# Altium schematic sheet Master.SchDoc
size A4; SheetNumber: 1; SheetTotal: 4
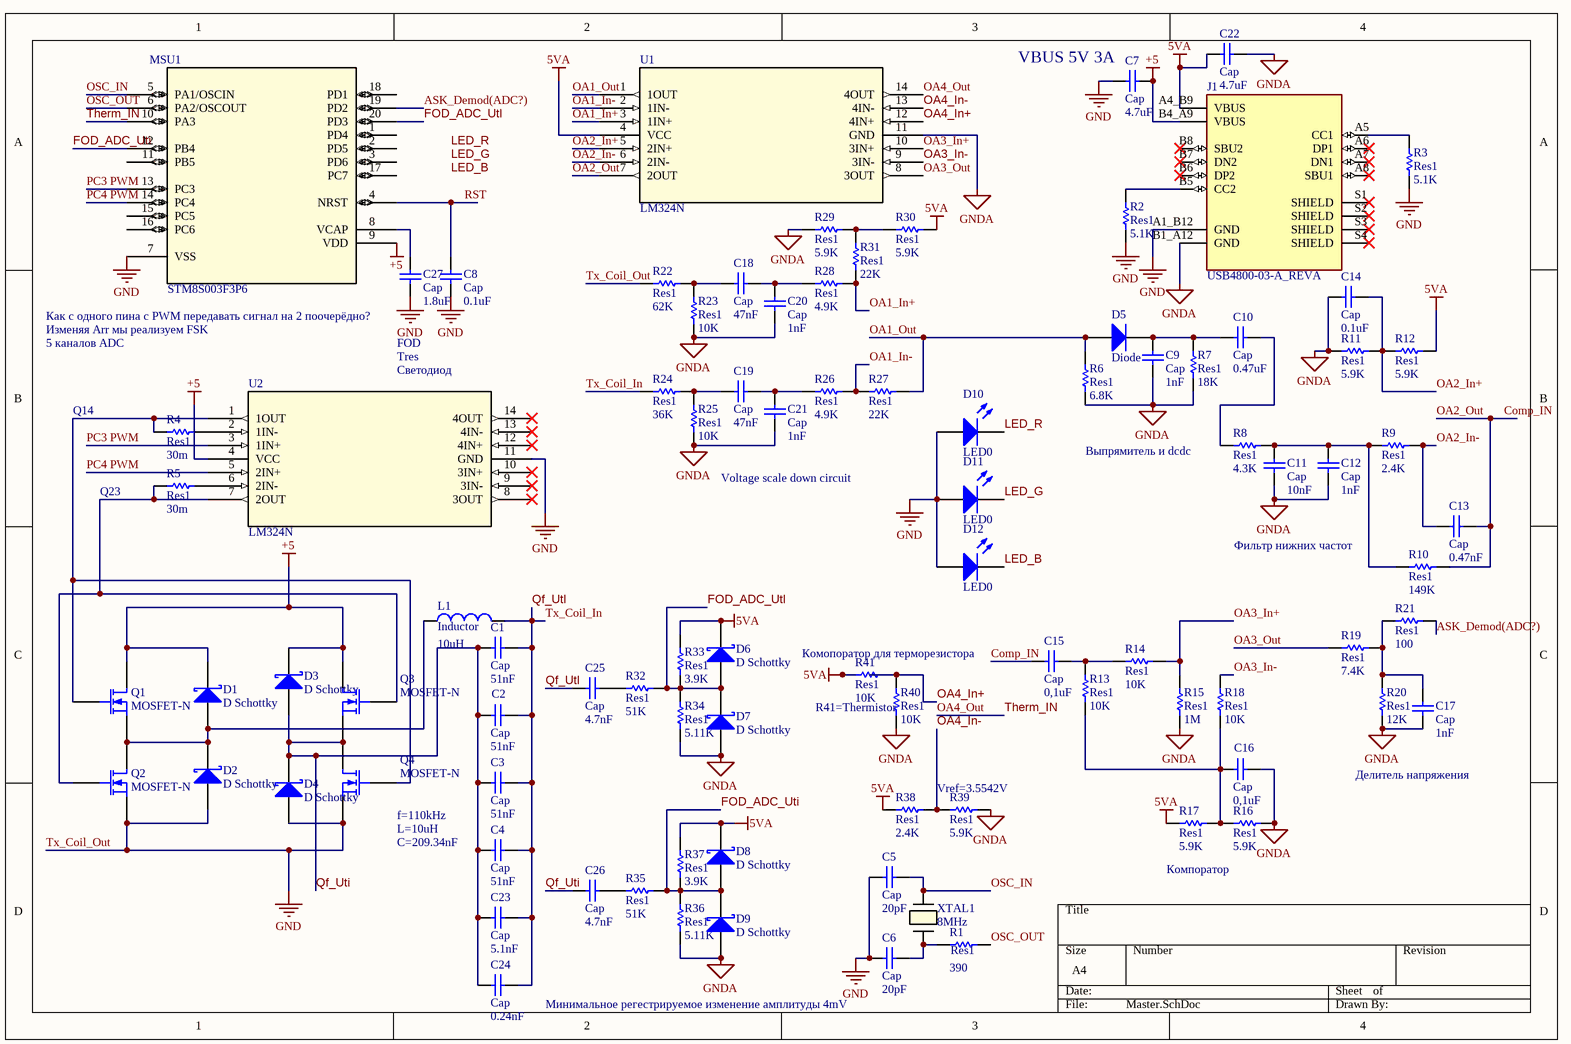
[diagram p0: Master.SchDoc]

## Parts
C1  Cap  value 51nF  [RAD-0.3]
C2  Cap  value 51nF  [RAD-0.3]
C3  Cap  value 51nF  [RAD-0.3]
C4  Cap  value 51nF  [RAD-0.3]
C5  Cap  value 20pF  [RAD-0.3]
C6  Cap  value 20pF  [RAD-0.3]
C7  Cap  value 4.7uF  [RAD-0.3]
C8  Cap  value 0.1uF  [RAD-0.3]
C9  Cap  value 1nF  [RAD-0.3]
C10  Cap  value 0.47uF  [RAD-0.3]
C11  Cap  value 10nF  [RAD-0.3]
C12  Cap  value 1nF  [RAD-0.3]
C13  Cap  value 0.47nF  [RAD-0.3]
C14  Cap  value 0.1uF  [RAD-0.3]
C15  Cap  value 0,1uF  [RAD-0.3]
C16  Cap  value 0,1uF  [RAD-0.3]
C17  Cap  value 1nF  [RAD-0.3]
C18  Cap  value 47nF  [RAD-0.3]
C19  Cap  value 47nF  [RAD-0.3]
C20  Cap  value 1nF  [RAD-0.3]
C21  Cap  value 1nF  [RAD-0.3]
C22  Cap  value 4.7uF  [RAD-0.3]
C23  Cap  value 5.1nF  [RAD-0.3]
C24  Cap  value 0.24nF  [RAD-0.3]
C25  Cap  value 4.7nF  [RAD-0.3]
C26  Cap  value 4.7nF  [RAD-0.3]
C27  Cap  value 1.8uF  [RAD-0.3]
D1  D Schottky  [SMB]
D2  D Schottky  [SMB]
D3  D Schottky  [SMB]
D4  D Schottky  [SMB]
D5  Diode  [SMC]
D6  D Schottky  [SMB]
D7  D Schottky  [SMB]
D8  D Schottky  [SMB]
D9  D Schottky  [SMB]
D10  LED0  [LED-0]
D11  LED0  [LED-0]
D12  LED0  [LED-0]
J1  USB4800-03-A_REVA  [GCT_USB4800-03-A_REVA]
L1  Inductor  value 10uH  [0402-A]
MSU1  STM8S003F3P6  [TSSOP20]
Q1  MOSFET-N  [E3]
Q2  MOSFET-N  [E3]
Q3  MOSFET-N  [E3]
Q4  MOSFET-N  [E3]
R1  Res1  value 390  [AXIAL-0.3]
R2  Res1  value 5.1K  [AXIAL-0.3]
R3  Res1  value 5.1K  [AXIAL-0.3]
R4  Res1  value 30m  [AXIAL-0.3]
R5  Res1  value 30m  [AXIAL-0.3]
R6  Res1  value 6.8K  [AXIAL-0.3]
R7  Res1  value 18K  [AXIAL-0.3]
R8  Res1  value 4.3K  [AXIAL-0.3]
R9  Res1  value 2.4K  [AXIAL-0.3]
R10  Res1  value 149K  [AXIAL-0.3]
R11  Res1  value 5.9K  [AXIAL-0.3]
R12  Res1  value 5.9K  [AXIAL-0.3]
R13  Res1  value 10K  [AXIAL-0.3]
R14  Res1  value 10K  [AXIAL-0.3]
R15  Res1  value 1M  [AXIAL-0.3]
R16  Res1  value 5.9K  [AXIAL-0.3]
R17  Res1  value 5.9K  [AXIAL-0.3]
R18  Res1  value 10K  [AXIAL-0.3]
R19  Res1  value 7.4K  [AXIAL-0.3]
R20  Res1  value 12K  [AXIAL-0.3]
R21  Res1  value 100  [AXIAL-0.3]
R22  Res1  value 62K  [AXIAL-0.3]
R23  Res1  value 10K  [AXIAL-0.3]
R24  Res1  value 36K  [AXIAL-0.3]
R25  Res1  value 10K  [AXIAL-0.3]
R26  Res1  value 4.9K  [AXIAL-0.3]
R27  Res1  value 22K  [AXIAL-0.3]
R28  Res1  value 4.9K  [AXIAL-0.3]
R29  Res1  value 5.9K  [AXIAL-0.3]
R30  Res1  value 5.9K  [AXIAL-0.3]
R31  Res1  value 22K  [AXIAL-0.3]
R32  Res1  value 51K  [AXIAL-0.3]
R33  Res1  value 3.9K  [AXIAL-0.3]
R34  Res1  value 5.11K  [AXIAL-0.3]
R35  Res1  value 51K  [AXIAL-0.3]
R36  Res1  value 5.11K  [AXIAL-0.3]
R37  Res1  value 3.9K  [AXIAL-0.3]
R38  Res1  value 2.4K  [AXIAL-0.3]
R39  Res1  value 5.9K  [AXIAL-0.3]
R40  Res1  value 10K  [AXIAL-0.3]
R41  Res1  value 10K  [AXIAL-0.3]
U1  LM324N  [N14]
U2  LM324N  [N14]
XTAL1  8MHz  [CRYSTAL_ECS-80-18-5PX-TR_ECS]

## Nets
5VA: C22.1 D6.2(K) D8.2(K) J1.A4_B9(VBUS) R12.2 R17.1 R30.2 R33.1 R37.2 R38.1 R41.1 U1.4(VCC)
+5: C7.1 D1.2(K) D3.2(K) J1.B4_A9(VBUS) MSU1.9(VDD) Q1.1(D) Q3.1(D) U2.4(VCC)
GNDA: C9.2 C11.1 C12.2 C14.1 C16.2 C17.2 C20.1 C21.2 C22.2 D7.1(A) D9.1(A) J1.B1_A12(GND) R6.2 R7.2 R11.1 R15.2 R16.2 R20.2 R23.2 R25.1 R29.2 R34.1 R36.1 R39.2 R40.1 U1.11(GND)
Tx_Coil_Out: C5.2 C6.2 C7.2 C8.1 C27.2 D2.1(A) D4.1(A) D10.1(A) D11.1(A) D12.1(A) J1.A1_B12(GND) MSU1.7(VSS) Q2.3(S) Q4.3(S) R2.2 R3.2 R22.2 U2.11(GND)  [also labelled GND]
ASK_Demod(ADC?): MSU1.19(PD2) R21.2
Comp_IN: C13.2 C15.1 R10.2 U1.7(2OUT)  [also labelled OA2_Out]
FOD_ADC_Uti: D8.1(A) D9.2(K) MSU1.12(PB4) R35.2 R36.2 R37.1
FOD_ADC_Utl: D6.1(A) D7.2(K) MSU1.20(PD3) R32.1 R33.2 R34.2
LED_B: D12.2(K)
LED_G: D11.2(K)
LED_R: D10.2(K)
OA1_In+: R28.1 R31.2 U1.3(1IN+)
OA1_In-: R26.2 R27.1 U1.2(1IN-)
OA1_Out: D5.1(A) R6.1 R27.2 U1.1(1OUT)
OA2_In+: C14.2 R11.2 R12.1 U1.5(2IN+)
OA2_In-: C13.1 R9.2 U1.6(2IN-)
OA3_In+: R14.2 R15.1 U1.10(3IN+)
OA3_In-: R18.2 U1.9(3IN-)
OA3_Out: R19.1 U1.8(3OUT)
OA4_In+: R40.2 R41.2 U1.12(4IN+)
OA4_In-: R38.2 R39.1 U1.13(4IN-)
OA4_Out: MSU1.10(PA3) U1.14(4OUT)  [also labelled Therm_IN]
OSC_IN: C5.1 MSU1.5(PA1/OSCIN) XTAL1.1
OSC_OUT: MSU1.6(PA2/OSCOUT) R1.2
PC3 PWM: MSU1.13(PC3) U2.3(1IN+)
PC4 PWM: MSU1.14(PC4) U2.5(2IN+)
Qf_Uti: C1.1 C2.1 C3.1 C4.1 C23.2 C24.1 C26.1 D3.1(A) D4.2(K) Q3.3(S) Q4.1(D)
Qf_Utl: C1.2 C2.2 C3.2 C4.2 C23.1 C24.2 C25.1 L1.2 R24.1  [also labelled Tx_Coil_In]
RST: C8.2 MSU1.4(NRST)
NetC6_1: C6.1 R1.1 XTAL1.2
NetC9_1: C9.1 C10.1 D5.2(K) R7.1
NetC10_2: C10.2 R8.2
NetC11_2: C11.2 C12.1 R8.1 R9.1 R10.1
NetC15_2: C15.2 R13.2 R14.1
NetC16_1: C16.1 R13.1 R16.1 R17.2 R18.1
NetC17_1: C17.1 R19.2 R20.1 R21.1
NetC18_1: C18.1 R22.1 R23.1
NetC18_2: C18.2 C20.2 R28.2
NetC19_1: C19.1 R24.2 R25.2
NetC19_2: C19.2 C21.1 R26.1
NetC25_2: C25.2 R32.2
NetC26_2: C26.2 R35.1
NetC27_1: C27.1 MSU1.8(VCAP)
NetD1_1: D1.1(A) D2.2(K) L1.1 Q1.3(S) Q2.1(D)
NetJ1_A5: J1.A5(CC1) R3.1
NetJ1_B5: J1.B5(CC2) R2.1
NetQ1_2: Q1.2(G) Q4.2(G) R4.1 U2.1(1OUT)
NetQ2_2: Q2.2(G) Q3.2(G) R5.1 U2.7(2OUT)
NetR4_2: R4.2 U2.2(1IN-)
NetR5_2: R5.2 U2.6(2IN-)
NetR29_1: R29.1 R30.1 R31.1

Not connected (* = marked no-connect by the designer): J1 A6(DP1)* A7(DN1)* A8(SBU1)* B6(DP2)* B7(DN2)* B8(SBU2)* S1(SHIELD)* S2(SHIELD)* S3(SHIELD)* S4(SHIELD)*; MSU1 1(PD4) 2(PD5) 3(PD6) 11(PB5) 15(PC5) 16(PC6) 17(PC7) 18(PD1); U2 8(3OUT)* 9(3IN-)* 10(3IN+)* 12(4IN+)* 13(4IN-)* 14(4OUT)*

## Notes on the sheet
- (near C7) VBUS 5V 3A
- (near C27) Как с одного пина с PWM передавать сигнал на 2 поочерёдно?
- Изменяя Arr мы реализуем FSK
- 5 каналов ADC
- FOD
- Tres
- (near U2) Светодиод
- Q14
- Выпрямитель и dcdc
- Q23
- Voltage scale down circuit
- Фильтр нижних частот
- (near R41) Комопоратор для терморезистора
- (near R40) R41=Thermistor
- Vref=3.5542V
- Делитель напряжения
- C=209.34nF
- (near Q4) f=110kHz
- L=10uH
- Компоратор
- Минимальное регестрируемое изменение амплитуды 4mV
- Labels drawn without touching a wire or pin: LED_B, LED_G, LED_R

## Library data of the parts
C1-C27 = Cap: Capacitor; Published: 8-Jun-2000; LatestRevisionDate: 17-Jul-2002; LatestRevisionNote: Re-released for DXP Platform.; PackageReference: RAD-0.3; Publisher: Altium Limited; PackageDescription: Radial Cap, Thru-Hole; 2 Leads; 0.3 in Pin Spacing
D1-D4 D6-D9 = D Schottky: Schottky Diode; Published: 8-Jun-2000; LatestRevisionDate: 17-Jul-2002; LatestRevisionNote: Re-released for DXP Platform.; PackageReference: SMB; Publisher: Altium Limited; PackageDescription: DO-214-AA/SMB; 2 C-Bend Leads; Body 5.3 x 3.6 mm, inc. leads (LxW); Code_JEDEC: DO-214-AA
D5 = Diode: Default Diode; Published: 8-Jun-2000; LatestRevisionDate: 17-Jul-2002; LatestRevisionNote: Re-released for DXP Platform.; PackageVersion: Sep-1996; PackageReference: SMC; Publisher: Altium Limited; PackageDescription: DO-214-AB/SMC; 2 C-Bend Leads; Body 7.9 x 5.9 mm, inc. leads (LxW); Code_JEDEC: DO-214-AB
D10-D12 = LED0: Typical INFRARED GaAs LED; Published: 8-Jun-2000; LatestRevisionDate: 08-Jul-2005; LatestRevisionNote: Mech Layer 1 removed.; PackageReference: LED-0; Publisher: Altium Limited; PackageDescription: LED; 2 Leads
J1 = USB4800-03-A_REVA: USB-C (USB TYPE-C) USB 2.0 Receptacle Connector 24 (16+8 Dummy) Position Surface Mount, Right Angle; Through Hole; MF: Global Connector Technology; SnapEDA_Link: https://www.snapeda.com/parts/USB4800-03-A/Global+Connector+Technology/view-part/?ref=snap; Package: None; MP: USB4800-03-A; Check_prices: https://www.snapeda.com/parts/USB4800-03-A/Global+Connector+Technology/view-part/?ref=eda; Purchase-URL: https://pricing.snapeda.com/search/part/USB4800-03-A/?ref=eda; Price: None; Value: *; Availability: In Stock
L1 = Inductor: Code_IEC: 1005; Published: 8-Jun-2000; LatestRevisionDate: 29-May-2009; LatestRevisionNote: IPC-7351 Footprint Added.; PackageReference: 0402-A; Publisher: Altium Limited; PackageDescription: Chip Inductor; Code_JEITA: 0402
MSU1 = STM8S003F3P6: No Description Available; Mfr_Name: STMicroelectronics; RefDes: RefDes; Type: Type
Q1-Q4 = MOSFET-N: N-Channel MOSFET; Published: 8-Jun-2000; LatestRevisionDate: 17-Jul-2002; LatestRevisionNote: Re-released for DXP Platform.; PackageVersion: 1995/1996; PackageReference: E3; Publisher: Altium Limited; PackageDescription: TO, Flat Index; 3 In-Line, Axial Leads; Body Dia. 4.6mm; Lead Dia. 0.5 mm (max)
R1-R41 = Res1: Resistor; Published: 8-Jun-2000; LatestRevisionDate: 17-Jul-2002; LatestRevisionNote: Re-released for DXP Platform.; PackageReference: AXIAL-0.3; Publisher: Altium Limited; PackageDescription: Axial Device, Thru-Hole; 2 Leads; 0.3 in Pin Spacing
U1 U2 = LM324N: No Description Available; Mfr_Name: Texas Instruments; RefDes: RefDes; Type: Type
XTAL1 = ECS-80-18-5PX-TR: No Description Available; Mfr_Name: ECS International